# EAGLE schematic protoCuantum (EAGLE 9.6.2)
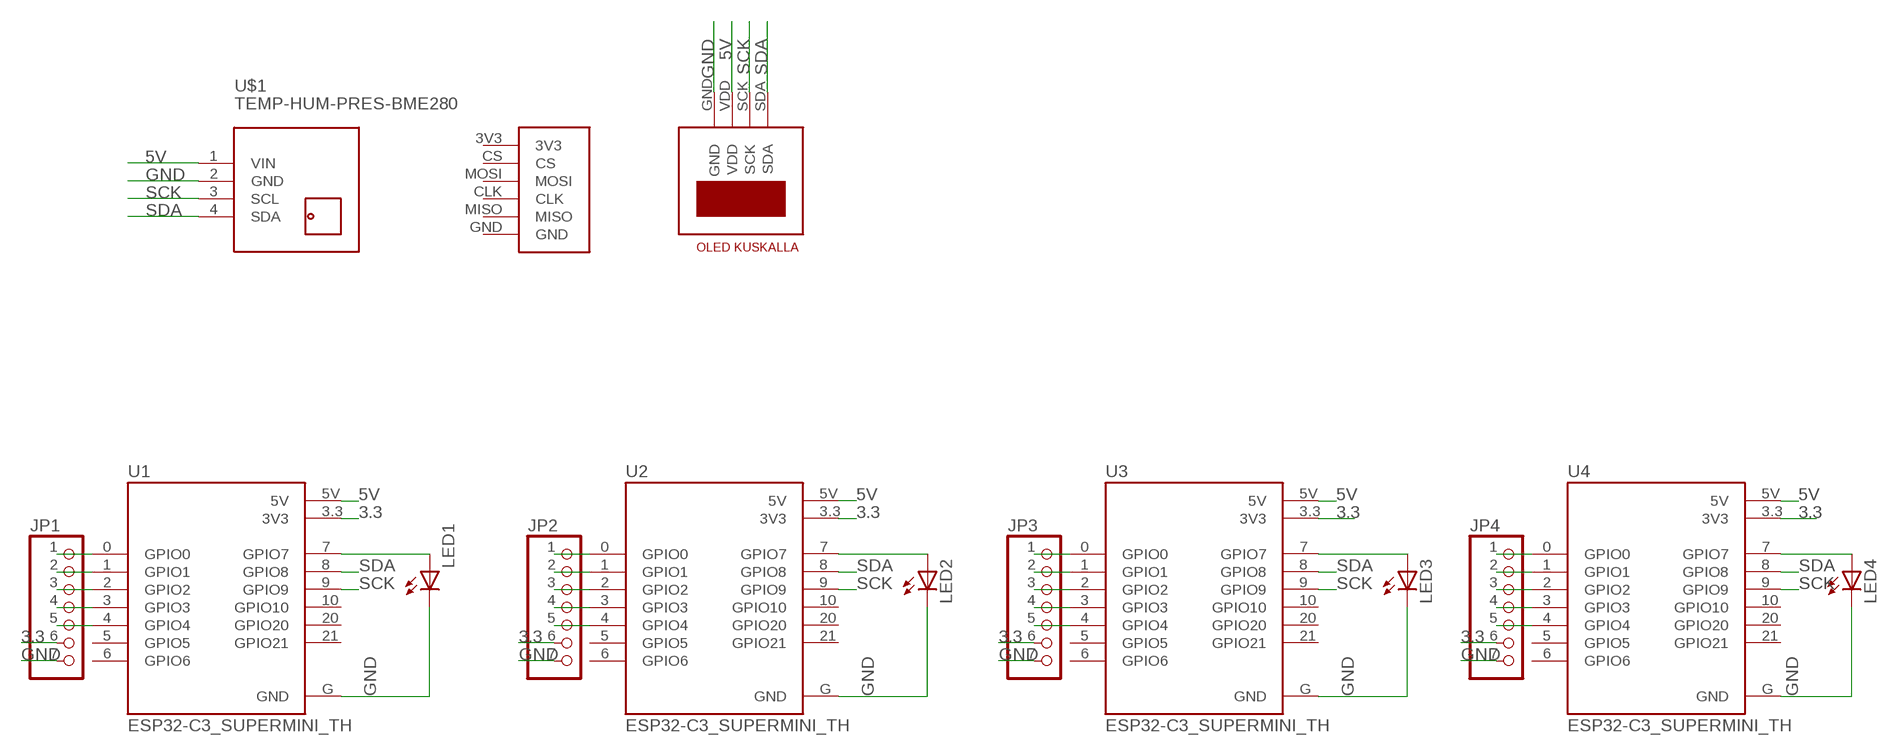
[diagram p0: schematic, sheet 1]

## Parts
JP1  PINHD-1X7  [1X07]
JP2  PINHD-1X7  [1X07]
JP3  PINHD-1X7  [1X07]
JP4  PINHD-1X7  [1X07]
LED1  LED3MM  [LED3MM]
LED2  LED3MM  [LED3MM]
LED3  LED3MM  [LED3MM]
LED4  LED3MM  [LED3MM]
U1  ESP32-C3_SUPERMINI_TH  [MODULE_ESP32-C3_SUPERMINI_TH]
U2  ESP32-C3_SUPERMINI_TH  [MODULE_ESP32-C3_SUPERMINI_TH]
U3  ESP32-C3_SUPERMINI_TH  [MODULE_ESP32-C3_SUPERMINI_TH]
U4  ESP32-C3_SUPERMINI_TH  [MODULE_ESP32-C3_SUPERMINI_TH]
U$1  TEMP-HUM-PRES-BME280  [TEMP-HUM-PRES-BME280]
U$2  SD_KUSKALLA  [SD_KUSKALLA]
U$3  OLED_KUSKALLA  [OLED_KUSKALLA]

## Nets
3.3: JP1.6 JP2.6 JP3.6 JP4.6 U1.3.3(3V3) U2.3.3(3V3) U3.3.3(3V3) U4.3.3(3V3)
5V: U1.5V U2.5V U3.5V U4.5V U$1.1(VIN) U$3.VDD
GND: JP1.7 JP2.7 JP3.7 JP4.7 LED1.K(C) LED2.K(C) LED3.K(C) LED4.K(C) U1.G(GND) U2.G(GND) U3.G(GND) U4.G(GND) U$1.2(GND) U$3.GND
N$1: LED2.A U2.7(GPIO7)
N$2: JP2.1 U2.0(GPIO0)
N$3: LED1.A U1.7(GPIO7)
N$7: U2.8(GPIO8)
N$8: U2.9(GPIO9)
N$11: JP4.1 U4.0(GPIO0)
N$12: JP4.2 U4.1(GPIO1)
N$13: LED3.A U3.7(GPIO7)
N$14: LED4.A U4.7(GPIO7)
N$15: JP1.1 U1.0(GPIO0)
N$16: JP1.2 U1.1(GPIO1)
N$17: JP1.3 U1.2(GPIO2)
N$18: JP1.4 U1.3(GPIO3)
N$19: JP1.5 U1.4(GPIO4)
N$20: JP2.2 U2.1(GPIO1)
N$21: JP2.3 U2.2(GPIO2)
N$22: JP2.4 U2.3(GPIO3)
N$23: JP2.5 U2.4(GPIO4)
N$24: JP3.1 U3.0(GPIO0)
N$25: JP3.2 U3.1(GPIO1)
N$26: JP3.3 U3.2(GPIO2)
N$27: JP3.4 U3.3(GPIO3)
N$28: JP3.5 U3.4(GPIO4)
N$29: JP4.3 U4.2(GPIO2)
N$30: JP4.4 U4.3(GPIO3)
N$31: JP4.5 U4.4(GPIO4)
SCK: U1.9(GPIO9) U3.9(GPIO9) U4.9(GPIO9) U$1.3(SCL) U$3.SCK
SDA: U1.8(GPIO8) U3.8(GPIO8) U4.8(GPIO8) U$1.4(SDA) U$3.SDA
Unconnected: U1.5(GPIO5) U1.6(GPIO6) U1.10(GPIO10) U1.20(GPIO20) U1.21(GPIO21) U2.5(GPIO5) U2.6(GPIO6) U2.10(GPIO10) U2.20(GPIO20) U2.21(GPIO21) U3.5(GPIO5) U3.6(GPIO6) U3.10(GPIO10) U3.20(GPIO20) U3.21(GPIO21) U4.5(GPIO5) U4.6(GPIO6) U4.10(GPIO10) U4.20(GPIO20) U4.21(GPIO21) U$2.3V3 U$2.CLK U$2.CS U$2.GND U$2.MISO U$2.MOSI

## Library data of the parts
JP1-JP4 = pinhead:PINHD-1X7: PIN HEADER
LED1-LED4 = adafruit:LED: LED OSRAM: - CHIPLED LG R971, LG N971, LY N971, LG Q971, LY Q971, LO R971, LY R971 LH N974, LH R974 LS Q976, LO Q976, LY Q976 LO Q996 - Hyper CHIPLED LW Q18S LB Q993, LB Q99A, LB R99A - SideLED LS A670, LO A670, LY A670, LG A670, LP A670 LB A673, LV A673, LT A673, LW A673 LH A674 LY A675 LS A676, LA A676, LO A676, LY A676, LW A676 LS A679, LY A679, LG A679 - Hyper Micro SIDELED® LS Y876, LA Y876, LO Y876, LY Y876 LT Y87S - SmartLED LW L88C, LW L88S LB L89C, LB L89S, LG L890 LS L89K, LO L89K, LY L89K LS L896, LA L896, LO L896, LY L896 - TOPLED LS T670, LO T670, LY T670, LG T670, LP T670 LSG T670, LSP T670, LSY T670, LOP T670, LYG T670 LG T671, LOG T671, LSG T671 LB T673, LV T673, LT T673, LW T673 LH T674 LS T676, LA T676, LO T676, LY T676, LB T676, LH T676, LSB T676, LW T676 LB T67C, LV T67C, LT T67C, LS T67K, LO T67K, LY T67K, LW E67C LS E67B, LA E67B, LO E67B, LY E67B, LB E67C, LV E67C, LT E67C LW T67C LS T679, LY T679, LG T679 LS T770, LO T770, LY T770, LG T770, LP T770 LB T773, LV T773, LT T773, LW T773 LH T774 LS E675, LA E675, LY E675, LS T675 LS T776, LA T776, LO T776, LY T776, LB T776 LHGB T686 LT T68C, LB T68C - Hyper Mini TOPLED® LB M676 - Mini TOPLED Santana® LG M470 LS M47K, LO M47K, LY M47K Source: http://www.osram.convergy.de/
U1-U4 = ESP32-C3_SUPERMINI_TH:ESP32-C3_SUPERMINI_TH: Check availability <https://pricing.snapeda.com/parts/ESP32-C3%20SuperMini_TH/Espressif%20Systems/view-part?ref=eda>; AVAILABILITY: Not in stock; CHECK_PRICES: https://www.snapeda.com/parts/ESP32-C3%20SuperMini_TH/Espressif+Systems/view-part/?ref=eda; DESCRIPTION: Super tiny ESP32-C3 board; MF: Espressif Systems; MP: ESP32-C3 SuperMini_TH; PACKAGE: Package; PRICE: None; SNAPEDA_LINK: https://www.snapeda.com/parts/ESP32-C3%20SuperMini_TH/Espressif+Systems/view-part/?ref=snap
U$1 = diy-modules:TEMP-HUM-PRES-BME280: Digital Humidity-Temperature-Pressure Sensor based on BME280 device More information about BME280 device is available here: https://www.bosch-sensortec.com/bst/products/all_products/bme280 Click here to find device on ebay.com <http://www.ebay.com/sch/bme280+breakout>
U$2 = SD_KUSKALLA:SD_KUSKALLA
U$3 = OLED_KUSKALLA:OLED_KUSKALLA